# Altium schematic sheet RS485.SchDoc: Motor Monitoring
size A3; Organization: NTUST EE-305; Address1: No.43, Sec. 4, Keelung Rd.; Address2: Da’an Dist.; Address3: Taipei 106; Address4: Taiwan (R.O.C.); Revision: 2.0; SheetNumber: 1; SheetTotal: 4
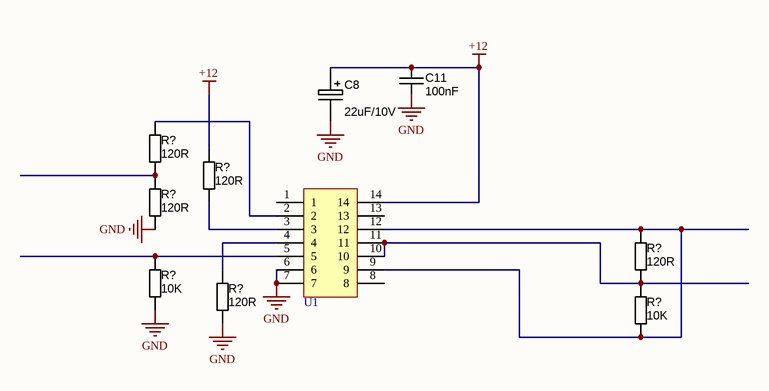
[diagram p0: RS485.SchDoc]

## Parts
(Parts that share a designator on the sheet are numbered #1, #2 ... from top to bottom, then left to right.)
C8  (no value)  [CAPC3225N]
C11  100nF  [CAPC1005L]
R?#1  value 120R  [RESC2012N]  (hidden comment: Thick Film)
R?#2  value 120R  [RESC2012N]  (hidden comment: Thick Film)
R?#3  value 120R  [RESC2012N]  (hidden comment: Thick Film)
R?#4  value 120R  [RESC2012N]  (hidden comment: Thick Film)
R?#5  value 10K  [RESC2012N]  (hidden comment: Thick Film)
R?#6  value 120R  [RESC2012N]  (hidden comment: Thick Film)
R?#7  value 10K  [RESC2012N]  (hidden comment: Thick Film)
U1  SOIC-14p  [MCHP-SOIC-SL14_L]  (value not drawn)

## Nets
+12: C8.1 C11.1 R?#2.1 U1.14
GND: C8.2 C11.2 R?#3.2 R?#5.2 R?#6.2 U1.6 U1.7
NetR?#1_1: R?#1.1 U1.2
NetR?#1_2: R?#1.2 R?#3.1
NetR?#2_2: R?#2.2 U1.3
NetR?#4_1: R?#4.1 R?#7.2 U1.9 U1.12
NetR?#4_2: R?#4.2 R?#7.1 U1.10 U1.11
NetR?#5_1: R?#5.1 U1.5
NetR?#6_1: R?#6.1 U1.4

Not connected (* = marked no-connect by the designer): U1 1 8 13

## Notes on the sheet
- Title
- Name
- Size:
- Revision:
- A3
- Date:
- Time:
- Sheet
- of
- (in symbol CAPT_100u_1210_6V3) 22uF/10V

## Library data of the parts
C8 = CAPT_100u_1210_6V3: Capacitor SMD Tantalum 100uF 20% 6.3V 1210; Manufacturer 1: AVX Corporation; Manufacturer Part Number 1: TCJB107M006R0045; Tolerance: ?0%; Package / Case: 1210 (3528 Metric); Material: Tantalum; Supplier 1: Digi-Key; Supplier Part Number 1: 478-4711-1-ND
C11 = CAPC_100n_0805: Capacitor SMD X7R; Manufacturer 1: Kemet; Manufacturer Part Number 1: C0805C104K5RACTU; Tolerance: ?0%; Ratings: 50V; X7R; Material: ceramic; Package / Case: 0805 (2012 metric); Supplier 1: Digi-Key; Supplier Part Number 1: 399-1170-1-ND; Value: 100nF
R?#1-R?#7 = RES_10K_0805_5%: Resistor SMD chip 10k Ohm 0.125W 5% 0805; Manufacturer 1: Yageo; Manufacturer Part Number 1: RC0805JR-0710KL; Ratings: 1/8 W; Tolerance: ?%; Package / Case: 0805 (2012 metric); Material: Thick Film; Supplier 1: Digi-Key; Supplier Part Number 1: 311-10KARCT-ND